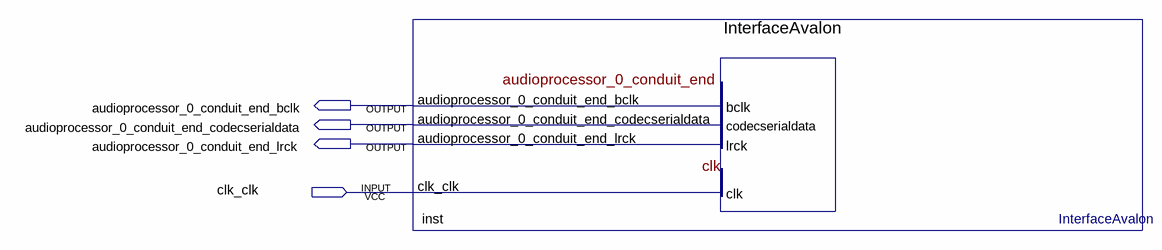
[diagram p0: schematic sheet]
// Quartus schematic audioProcessor.bdf as structural Verilog: 1 symbols, 4 pins
module audioProcessor (
  input  clk_clk,
  output audioprocessor_0_conduit_end_bclk,
  output audioprocessor_0_conduit_end_codecserialdata,
  output audioprocessor_0_conduit_end_lrck
);

  InterfaceAvalon inst (
    .clk_clk(clk_clk), .audioprocessor_0_conduit_end_bclk(audioprocessor_0_conduit_end_bclk),
    .audioprocessor_0_conduit_end_codecserialdata(audioprocessor_0_conduit_end_codecserialdata),
    .audioprocessor_0_conduit_end_lrck(audioprocessor_0_conduit_end_lrck));
endmodule
